# Altium schematic sheet Laser protection.SchDoc: AI ARTIQ Driver
size 420 x 297 mm; Author: G.Kasprowicz; CompanyName: CTI; Organization: CTI; Address1: CTI; Address2: Nowowiejska 15/19 00-665 Warsaw; Address3: gkasprow@gmail.com; DocumentNumber: 6; Revision: 0.2; SheetNumber: 6; SheetTotal: 11; ModifiedBy: -; CheckedDate: -; Title2: protection; DivGrp: CTI; ModifiedDate: -; ProjectName: Sensor Box
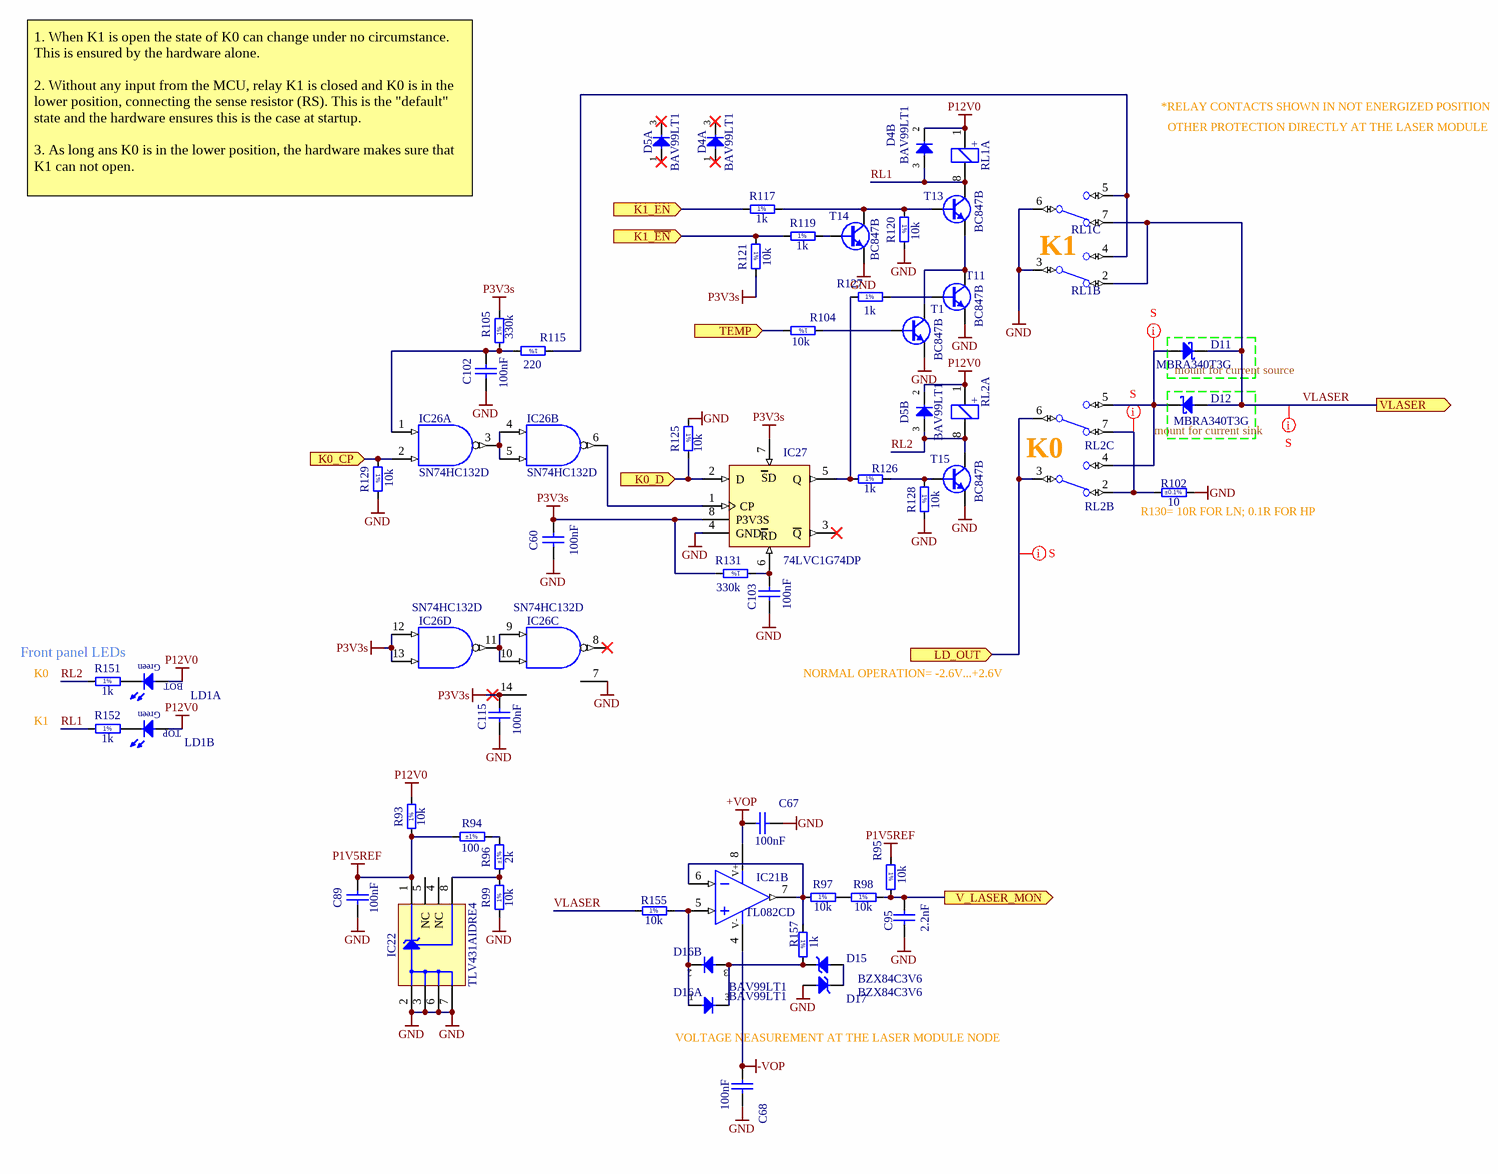
[diagram p0: Laser protection.SchDoc]

## Parts
C60  100nF  [CAPC1608X87N]
C67  100nF  [CAPC1608X87N]
C68  100nF  [CAPC1608X87N]
C89  100nF  [CAPC1608X87N]
C95  2.2nF  [CAPC1608X87N]
C102  100nF  [CAPC1608X87N]
C103  100nF  [CAPC1608X87N]
C115  100nF  [CAPC1608X87N]
D4  BAV99LT1  [SOT95P240X110-3N]  (parts A,B of 2)
D5  BAV99LT1  [SOT95P240X110-3N]  (parts A,B of 2)
D11  MBRA340T3G  [DIOM5226X220N]
D12  MBRA340T3G  [DIOM5226X220N]
D15  BZX84C3V6  [SOT95P240X130-3N]
D16  BAV99LT1  [SOT95P240X110-3N]  (parts A,B of 2)
D17  BZX84C3V6  [SOT95P240X130-3N]
IC21  TL082CD  [SOIC127P600X175-8N]  (part B of 2)
IC22  TLV431AIDRE4  [SOIC127P600X175-8N]
IC26  SN74HC132D  [SOIC127P600X175-14N]  (parts A,B,C,D of 4)
IC27  74LVC1G74DP  [SOP65P400X110-8N]
LD1  Green/Green  [LED_DIALIGHT_571-0122F]  (value not drawn)  (parts A,B of 2)
R93  10k  [RESC1608X55N]
R94  100  Tolerance: ±1%  [RESC1608X55N]
R95  10k  [RESC1608X55N]
R96  2k  Tolerance: ±1%  [RESC1608X55N]
R97  10k  [RESC1608X55N]
R98  10k  [RESC1608X55N]
R99  10k  [RESC1608X55N]
R102  10  Tolerance: ±0.1%  [RESC6531X85N]
R104  10k  [RESC1608X55N]
R105  330k  [RESC1608X55N]
R115  220  [RESC1608X55N]
R117  1k  [RESC1608X55N]
R119  1k  [RESC1608X55N]
R120  10k  [RESC1608X55N]
R121  10k  [RESC1608X55N]
R125  10k  [RESC1608X55N]
R126  1k  [RESC1608X55N]
R127  1k  [RESC1608X55N]
R128  10k  [RESC1608X55N]
R129  10k  [RESC1608X55N]
R131  330k  [RESC1608X55N]
R151  1k  [RESC1608X55N]
R152  1k  [RESC1608X55N]
R155  10k  [RESC1608X55N]
R157  1k  [RESC1608X55N]
RL1  REL_TYCO_IM Non-latching  [REL_TYCO_IMXXXGX]  (value not drawn)  (parts A,B,C of 3)
RL2  REL_TYCO_IM Non-latching  [REL_TYCO_IMXXXGX]  (value not drawn)  (parts A,B,C of 3)
T1  BC847B  [SOT95P230X110-3N]
T11  BC847B  [SOT95P230X110-3N]
T13  BC847B  [SOT95P230X110-3N]
T14  BC847B  [SOT95P230X110-3N]
T15  BC847B  [SOT95P230X110-3N]

## Blocks framed on the sheet
mount for current source: D11

## Ports
K0_CP (in), K0_D (in), K1_EN (in), K1_~{EN} (in), LD_OUT (in), TEMP (in), V_LASER_MON (out), VLASER (out)

## Nets
+VOP: C67.1 IC21.8(V+)
-VOP: C68.1 IC21.4(V-)
GND: C60.1 C67.2 C68.2 C89.1 C95.1 C102.1 C103.1 C115.1 D17.1(A) IC22.2(A) IC22.3(A) IC22.6(A) IC22.7(A) IC26.7(GND) IC27.4(GND) R99.1 R102.2 R120.2 R125.1 R128.2 R129.2 RL1.3(C) RL1.6(C) T1.2(E) T11.2(E) T14.2(E) T15.2(E)
P1V5REF: C89.2 IC22.1(C) R93.1 R94.2 R95.1
P3V3s: C60.2 C115.2 IC26.12(A) IC26.13(B) IC26.14(VCC) IC27.7(~{S}D) IC27.8(P3V3S) R105.2 R121.2 R131.2  [also labelled VCC]
P12V0: D4.2(C) D5.2(C) LD1.2(A) LD1.4(A) R93.2 RL1.1 RL2.1
K0_CP: IC26.2(B) R129.1 ; port K0_CP
K0_D: IC27.2(D) R125.2 ; port K0_D
K1_~{EN}: R119.1 R121.1 ; port K1_~{EN}
K1_EN: R117.1 ; port K1_EN
LD_OUT: RL2.3(C) RL2.6(C) ; port LD_OUT
RL1: D4.3(COMAC) R152.1 RL1.8 T13.3(C)
RL2: D5.3(COMAC) R151.1 RL2.8 T15.3(C)
TEMP: R104.2 ; port TEMP
V_LASER_MON: C95.2 R95.2 R98.2 ; port V_LASER_MON
VLASER: D11.1(C) D12.2(A) R155.1 RL1.2(NC) RL1.7(NC) ; port VLASER
NetC102_2: C102.2 IC26.1(A) R105.1 R115.2
NetC103_2: C103.2 IC27.6(~{RD}) R131.1
NetD11_2: D11.2(A) D12.1(C) RL2.4(NO) RL2.5(NO)
NetD15_1: D15.1(A) D17.3(C)
NetD15_3: D15.3(C) D16.3(COMAC) R157.2
NetD16_1: D16.1(A) D16.2(C) IC21.5(IN+) R155.2
NetIC21_6: IC21.6(IN-) IC21.7(OUT) R97.1 R157.1
NetIC22_8: IC22.8(REF) R96.1 R99.2
NetIC26_3: IC26.3(~{O}) IC26.4(A) IC26.5(B)
NetIC26_6: IC26.6(~{O}) IC27.1(CP)
NetIC26_9: IC26.9(A) IC26.10(B) IC26.11(~{O})
NetIC27_5: IC27.5(Q) R126.1 R127.1
NetLD1_1: LD1.1(C) R151.2
NetLD1_3: LD1.3(C) R152.2
NetR94_1: R94.1 R96.2
NetR97_2: R97.2 R98.1
NetR102_1: R102.1 RL2.2(NC) RL2.7(NC)
NetR104_1: R104.1 T1.1(B)
NetR115_1: R115.1 RL1.4(NO) RL1.5(NO)
NetR117_2: R117.2 R120.1 T13.1(B) T14.3(C)
NetR119_2: R119.2 T14.1(B)
NetR126_2: R126.2 R128.1 T15.1(B)
NetR127_2: R127.2 T11.1(B)
NetT1_3: T1.3(C) T11.3(C) T13.2(E)

Not connected (* = marked no-connect by the designer): D4 1(A)*; D5 1(A)*; IC22 4(NC) 5(NC); IC26 8(~{O})*; IC27 3(~{Q})*

## Layout directives
net class Sensitive: LD_OUT, NetD11_2, NetR102_1, VLASER

## Notes on the sheet
- *RELAY CONTACTS SHOWN IN NOT ENERGIZED POSITION
- OTHER PROTECTION DIRECTLY AT THE LASER MODULE
- 1. When K1 is open the state of K0 can change under no circumstance. This is ensured by the hardware alone.
  2. Without any input from the MCU, relay K1 is closed and K0 is in the lower position, connecting the sense resistor (RS). This is the "default" state and the hardware ensures this is the case at startup.
  3. As long ans K0 is in the lower position, the hardware makes sure that K1 can not open.
- (near RL1) K1
- (near D12) mount for current sink
- (near RL2) K0
- (near R102) R130= 10R FOR LN; 0.1R FOR HP
- Front panel LEDs
- K0
- NORMAL OPERATION= -2.6V...+2.6V
- K1
- VOLTAGE NEASUREMENT AT THE LASER MODULE NODE
- Project/Equipment
- Document
- Designer
- Drawn by
- Check.by
- Copyright Creotech Instruments SA 2014.
  This documentation describes Open Hardware and is licensed under the CERN OHL v.1.1. You may redistribute and modify this documentation under the terms of the CERN OHL v.1.1. (http://ohwr.org/CERNOHL). This documentation is distributed WITHOUT ANY EXPRESS OR IMPLIED WARRANTY, INCLUDING OF MERCHANTABILITY, SATISFACTORY QUALITY AND FITNESS FOR A PARTICULAR PURPOSE. Please see the CERN OHL v.1.1 for applicable conditions.
- File
- Last Mod.
- Print Date
- Sheet
- Size
- A3
- of
- Rev
- (in symbol 74LVC1G74DP) SD; RD
- (in symbol LED_DIALIGHT_571-0122F, part A) Green; BOT
- (in symbol LED_DIALIGHT_571-0122F, part B) Green; TOP
- (in symbol R0603_1K_1%_0.1W_100PPM) 1%
- (in symbol R0603_10K_1%_0.1W_100PPM) 1%
- (in symbol R0603_220R_1%_0.1W_100PPM) 1%
- (in symbol R0603_330K_1%_0.1W_100PPM) 1%
- (in symbol REL_TYCO_IM06CGR, part A) +

## Library data of the parts
C60 C67 C68 C89 C102 C103 C115 = CC0603_100NF_50V_10%_X7R: Non-polarised capacitor; Part Description: SMD Multilayer Chip Ceramic Capacitor; Manufacturer: GENERIC; Manufacturer1 Part Number: 223858615649; Voltage: 50V; TC: X7R; Tolerance: ±10%; Part Number: CC0603_100NF_50V_10%_X7R; Component Kind: Standard; Component Type: Standard; Pin Count: 2; Value: 100nF; Status: Preferred; Manufacturer Part Number: CC0603_100NF_50V_10%_X7R; Case: 0603; Mounted: Yes; Socket: No; SMD: Yes; Sense: No; Manufacturer1 Example: PHYCOMP; Manufacturer1 ComponentHeight: 0.87mm; HelpURL: \\cern.ch\dfs\Applications\Altium\Datasheets\CC0603_X7R_PHYCOMP.pdf; Author: CERN DEM JLC; CreateDate: 03.12.2007; LatestRevisionDate: 03.12.2007
C95 = CC0603_2.2NF_50V_5%_C0G: Non-polarised capacitor; Part Description: SMD Multilayer Chip Ceramic Capacitor; Manufacturer: GENERIC; Manufacturer1 Part Number: C1608C0G1H222J080AA; Voltage: 50V; TC: C0G/NP0; Tolerance: ±5%; Part Number: CC0603_2.2NF_50V_5%_C0G; Component Kind: Standard; Component Type: Standard; Pin Count: 2; Value: 2.2nF; Status: Preferred; Manufacturer Part Number: CC0603_2.2NF_50V_5%_C0G; Case: 0603; Mounted: Yes; Socket: No; SMD: Yes; Sense: No; Manufacturer1 Example: TDK; Manufacturer1 ComponentHeight: 0.9mm; HelpURL: \\cern.ch\dfs\Applications\Altium\Datasheets\CC0603_C0G_TDK_C.pdf; Author: CERN DEM JMW; CreateDate: 23.06.2014; LatestRevisionDate: 23.06.2014
D4 D5 D16 = BAV99LT1: Serial Diode; Part Description: Dual Series Switching Diode; Manufacturer: ON SEMICONDUCTOR; Voltage: 70V; Power: 225mW; PressFit: No; Bonding: No; Part Number: BAV99LT1; Component Kind: Standard; Component Type: Standard; Device: BAV99LT1; PackageDescription: SOT, 0.95mm Pitch; 3 Pin, 1.40mm W X 3.00mm L X 1.10mm H body, IPC Medium Density; Status: Obsolete; Manufacturer Part Number: BAV99LT1; Pin Count: 3; Case: SOT23-3; Mounted: Yes; Socket: No; SMD: Yes; Sense: No; ComponentHeight: 1.11mm; HelpURL: \\cern.ch\dfs\Applications\Altium\Datasheets\BAV99LT1.pdf; Author: CERN DEM JLC; CreateDate: 12.02.2009; LatestRevisionDate: 12.02.2009
D11 D12 = MBRA340T3G: Schottky Diode; Part Description: Schottky Power Rectifier; Manufacturer: ON SEMICONDUCTOR; Voltage: 40V; Power: 3A; PressFit: No; Bonding: No; Part Number: MBRA340T3G; Component Kind: Standard; Component Type: Standard; Device: MBRA340T3G; PackageDescription: DO-214-AC/SMA Diode, Molded Body; 5.21mm L X 2.60mm W X 2.20mm H, IPC Medium Density; Manufacturer Part Number: MBRA340T3G; Pin Count: 2; Case: DO-214AC; Mounted: Yes; Socket: No; SMD: Yes; Sense: No; ComponentHeight: 2.20mm; HelpURL: \\cern.ch\dfs\Applications\Altium\Datasheets\MBRA340T3G.pdf; Author: CERN DEM JLC; CreateDate: 18.06.2012; LatestRevisionDate: 18.06.2012
D15 D17 = BZX84C3V6: Diode Zener Anode Pin 1 Cathode Pin 3 (Pas de pin 2); Part Description: Zener Diode; Manufacturer: FAIRCHILD SEMICONDUCTOR; Voltage: 3V6; Power: 350mW; PressFit: No; Bonding: No; Part Number: BZX84C3V6; Component Kind: Standard; Component Type: Standard; Device: BZX84C3V6; PackageDescription: SOT, 0.95mm Pitch; 3 Pin, 1.30mm W X 2.90mm L X 1.30mm H body, IPC Medium Density; Manufacturer Part Number: BZX84C3V6; Pin Count: 3; Case: SOT23-3; Mounted: Yes; Socket: No; SMD: Yes; Sense: No; ComponentHeight: 1.3mm; HelpURL: \\cern.ch\dfs\Applications\Altium\Datasheets\BZX84C3V6.pdf; Author: CERN DEM JLC; CreateDate: 06.10.2016; LatestRevisionDate: 06.10.2016
IC21 = TL082CD: Dual Operational Amplifier; Part Description: Dual JFET-Input Operational Amplifier; Manufacturer: TEXAS INSTRUMENTS; PressFit: No; Bonding: No; Part Number: TL082CD; Component Kind: Standard; Component Type: Standard; Device: TL082CD; PackageDescription: SOIC 8, Pitch 1.27mm - Body 4x5mm, IPC Medium Density; Manufacturer Part Number: TL082CD; Pin Count: 8; Case: SOIC8; Mounted: Yes; Socket: No; SMD: Yes; Sense: No; ComponentHeight: 1.75mm; Author: CERN DEM JLC; HelpURL: \\cern.ch\dfs\Applications\Altium\Datasheets\TL082CD.pdf; CreateDate: 20.05.2010; LatestRevisionDate: 20.05.2010
IC22 = TL431CD: Precision Programmable Reference; Part Description: Vref (1.25V) To 36V 2% Precision Programmable Reference; Manufacturer: TEXAS INSTRUMENTS; PressFit: No; Bonding: No; Part Number: TLV431AIDRE4; Component Kind: Standard; Component Type: Standard; Device: TLV431AIDRE4; PackageDescription: SOIC 8, Pitch 1.27mm, Body 4x5mm, IPC Medium Density; Manufacturer Part Number: TLV431AIDRE4; Pin Count: 8; Case: SOIC8; Mounted: Yes; Socket: No; SMD: Yes; Sense: No; ComponentHeight: 1.75mm; HelpURL: \\cern.ch\dfs\Applications\Altium\Datasheets\TL431CD.pdf; Author: CERN DEM JLC; CreateDate: 18.01.2011; LatestRevisionDate: 28.02.2011
IC26 = SN74HC132D: Quad Positive NAND Gate With Schmitt-Trigger Input; Manufacturer: TEXAS INSTRUMENTS; PressFit: No; Bonding: No; Part Number: SN74HC132D; Component Kind: Standard; Component Type: Standard; Device: SN74HC132D; PackageDescription: SOIC 14, Pitch 1.27mm - Body 4x8.75mm, IPC Medium Density; Part Description: Quad Positive NAND Gate With Schmitt-Trigger Input; Manufacturer Part Number: SN74HC132D; Pin Count: 14; Case: SOIC14; Mounted: Yes; Socket: No; SMD: Yes; Sense: No; ComponentHeight: 1.75mm; Author: CERN DEM JLC; HelpURL: \\cern.ch\dfs\Applications\Altium\Datasheets\SN74HC132D.pdf; CreateDate: 21.08.2008; LatestRevisionDate: 21.08.2008
IC27 = 74LVC1G74DP: Single D-type flip-flop with set and reset, positive edge trigger; Manufacturer: NXP SEMICONDUCTORS; PressFit: No; Bonding: No; Part Number: 74LVC1G74DP; Component Kind: Standard; Component Type: Standard; Device: 74LVC1G74DP; PackageDescription: SOP, 0.65mm, pitch; 8 pin, 3.00mm W X 3.00mm L X 1.10mm H body, PC Medium Density; Part Description: Single D-Type Flip-Flop With Set And Reset, Positive Edge Trigger; Manufacturer Part Number: 74LVC1G74DP; Pin Count: 8; Case: TSSOP8; Mounted: Yes; Socket: No; SMD: Yes; Sense: No; ComponentHeight: 1.1mm; Author: CERN DEM JLC; HelpURL: \\cern.ch\dfs\Applications\Altium\Datasheets\74LVC1G74DP.pdf; CreateDate: 26.04.2010; LatestRevisionDate: 26.04.2010
LD1 = LED_DIALIGHT_571-0122F: LED x2 Green 1C2A-BOT_3C4A-TOP; Part Description: Dual 2mm Green LEDs CBI® Circuit Board Indicator (Without positioning pins); PressFit: No; Bonding: No; Part Number: LED_DIALIGHT_571-0122F; Component Kind: Standard; Component Type: Standard; Color: Green/Green; PackageDescription: 2x 2mm Red LED PCB Edge Mounting (Without positioning pins) DIALIGHT 571 Serie; Manufacturer: DIALIGHT; Manufacturer Part Number: 571-0122F; Pin Count: 4; Mounted: Yes; Socket: No; SMD: No; Sense: No; ComponentHeight: 8.6mm; HelpURL: \\cern.ch\dfs\Applications\Altium\Datasheets\LED_DIALIGHT_571-0122F.pdf; Author: CERN DEM JLC; CreateDate: 09.11.2009; LatestRevisionDate: 17.03.2010
R93 R95 R97-R99 R104 R120 R121 R125 R128 R129 R155 = R0603_10K_1%_0.1W_100PPM: Resistor - 1%; Part Description: General Purpose Thick Film Chip Resistor; Manufacturer: GENERIC; Manufacturer1 Part Number: NRC06F1002TRF; Power: 0.1W; TC: ±100ppm/°C; PressFit: No; Part Number: R0603_10K_1%_0.1W_100PPM; Component Kind: Standard; Component Type: Standard; Pin Count: 2; Value: 10k; Status: Preferred; Tolerance: ±1%; Manufacturer Part Number: R0603_10K_1%_0.1W_100PPM; Case: 0603; Mounted: Yes; Sense: No; Socket: No; SMD: Yes; Manufacturer1 Example: NIC COMPONENT; Manufacturer1 ComponentHeight: 0.55mm; HelpURL: \\cern.ch\dfs\Applications\Altium\Datasheets\R0603_NIC_NRC.pdf; Author: CERN DEM JLC; CreateDate: 03.12.2007; LatestRevisionDate: 13.03.2008
R94 = R0603_100R_1%_0.1W_100PPM: Resistor - 1%; Part Description: General Purpose Thick Film Chip Resistor; Manufacturer: GENERIC; Manufacturer1 Part Number: NRC06F4700TRF; Power: 0.1W; TC: ±100ppm/°C; PressFit: No; Part Number: R0603_100R_1%_0.1W_100PPM; Component Kind: Standard; Component Type: Standard; Pin Count: 2; Value: 100; Status: Preferred; Manufacturer Part Number: R0603_100R_1%_0.1W_100PPM; Case: 0603; Mounted: Yes; Sense: No; Socket: No; SMD: Yes; Manufacturer1 Example: NIC COMPONENT; Manufacturer1 ComponentHeight: 0.55mm; HelpURL: \\cern.ch\dfs\Applications\Altium\Datasheets\R0603_NIC_NRC.pdf; Author: CERN DEM JLC; CreateDate: 03.12.2007; LatestRevisionDate: 13.03.2008
R96 = R0603_2K_1%_0.1W_100PPM: Resistor - 1%; Part Description: General Purpose Thick Film Chip Resistor; Manufacturer: GENERIC; Manufacturer1 Part Number: NRC06F2001TRF; Power: 0.1W; TC: ±100ppm/°C; PressFit: No; Part Number: R0603_2K_1%_0.1W_100PPM; Component Kind: Standard; Component Type: Standard; Pin Count: 2; Value: 2k; Status: Preferred; Manufacturer Part Number: R0603_2K_1%_0.1W_100PPM; Case: 0603; Mounted: Yes; Sense: No; Socket: No; SMD: Yes; Manufacturer1 Example: NIC COMPONENT; Manufacturer1 ComponentHeight: 0.55mm; HelpURL: \\cern.ch\dfs\Applications\Altium\Datasheets\R0603_NIC_NRC.pdf; Author: CERN DEM JLC; CreateDate: 03.12.2007; LatestRevisionDate: 13.03.2008
R102 = R2512_10R_0.1%_2.5W_25PPM: Resistor - 0.1%; Part Description: High Power Thin Film Wraparound Chip Resistor; Manufacturer: VISHAY DALE; Manufacturer Part Number: PHP02512E10R0BST3; Power: 2.5W; TC: ±25ppm/°C; PressFit: No; Part Number: R2512_10R_0.1%_2.5W_25PPM; Component Kind: Standard; Component Type: Standard; Pin Count: 2; Value: 10; Status: Not Recommended; Case: 2512; Mounted: Yes; Sense: No; Socket: No; SMD: Yes; ComponentHeight: 0.84mm; HelpURL: \\cern.ch\dfs\Applications\Altium\Datasheets\R2512_VISHAY_PHP.pdf; Author: CERN DEM JLC; CreateDate: 06.06.2017; LatestRevisionDate: 06.06.2017
R105 R131 = R0603_330K_1%_0.1W_100PPM: Resistor - 1%; Part Description: General Purpose Thick Film Chip Resistor; Manufacturer: GENERIC; Manufacturer1 Part Number: NRC06F3303TRF; Power: 0.1W; TC: ±100ppm/°C; PressFit: No; Part Number: R0603_330K_1%_0.1W_100PPM; Component Kind: Standard; Component Type: Standard; Pin Count: 2; Value: 330k; Status: Preferred; Tolerance: ±1%; Manufacturer Part Number: R0603_330K_1%_0.1W_100PPM; Case: 0603; Mounted: Yes; Sense: No; Socket: No; SMD: Yes; Manufacturer1 Example: NIC COMPONENT; Manufacturer1 ComponentHeight: 0.55mm; HelpURL: \\cern.ch\dfs\Applications\Altium\Datasheets\R0603_NIC_NRC.pdf; Author: CERN DEM JLC; CreateDate: 03.12.2007; LatestRevisionDate: 13.03.2008
R115 = R0603_220R_1%_0.1W_100PPM: Resistor - 1%; Part Description: General Purpose Thick Film Chip Resistor; Manufacturer: GENERIC; Manufacturer1 Part Number: NRC06F2200TRF; Power: 0.1W; TC: ±100ppm/°C; Part Number: R0603_220R_1%_0.1W_100PPM; Component Kind: Standard; Component Type: Standard; Pin Count: 2; Value: 220; Status: Preferred; Tolerance: ±1%; Manufacturer Part Number: R0603_220R_1%_0.1W_100PPM; Case: 0603; Mounted: Yes; Sense: No; Socket: No; SMD: Yes; Manufacturer1 Example: NIC COMPONENT; Manufacturer1 ComponentHeight: 0.55mm; HelpURL: \\cern.ch\dfs\Applications\Altium\Datasheets\R0603_NIC_NRC.pdf; Author: CERN DEM JLC; CreateDate: 03.12.2007; LatestRevisionDate: 13.03.2008
R117 R119 R126 R127 R151 R152 R157 = R0603_1K_1%_0.1W_100PPM: Resistor - 1%; Part Description: General Purpose Thick Film Chip Resistor; Manufacturer: GENERIC; Manufacturer1 Part Number: NRC06F1001TRF; Power: 0.1W; TC: ±100ppm/°C; PressFit: No; Part Number: R0603_1K_1%_0.1W_100PPM; Component Kind: Standard; Component Type: Standard; Pin Count: 2; Value: 1k; Status: Preferred; Tolerance: ±1%; Manufacturer Part Number: R0603_1K_1%_0.1W_100PPM; Case: 0603; Mounted: Yes; Sense: No; Socket: No; SMD: Yes; Manufacturer1 Example: NIC COMPONENT; Manufacturer1 ComponentHeight: 0.55mm; HelpURL: \\cern.ch\dfs\Applications\Altium\Datasheets\R0603_NIC_NRC.pdf; Author: CERN DEM JLC; CreateDate: 03.12.2007; LatestRevisionDate: 13.03.2008
RL1 RL2 = REL_TYCO_IM06CGR: IM Signal Relay (Monostable 1 Coil Non-latching); Part Description: 2A/250VAC, DPDT  (2 Form C) SMT High Dielectric Signal Relay, IM Series; Manufacturer: TYCO AXICOM; Manufacturer Part Number: IM06CGR or 9-1462037-9; PressFit: No; Value: 12VDC; Sense Comment: Cleaning Limitation; Status Comment: Sensitive (See Sensitive Field); Part Number: REL_TYCO_IM06CGR; Component Kind: Standard; Component Type: Standard; Pin Count: 8; PackageDescription: 8 Gull Wings Leads SMT Relay, IM Series, Body 10mm x 6mm; Mounted: Yes; Socket: No; SMD: Yes; Sense: Yes; Status: Not Recommended; ComponentHeight: 5.65mm; HelpURL: \\cern.ch\dfs\Applications\Altium\Datasheets\REL_TYCO_IM06CGR.pdf; Author: CERN DEM JLC; CreateDate: 04.12.2013; LatestRevisionDate: 04.12.2013
T1 T11 T13-T15 = BC847B: NPN Transistor; Part Description: 45V 100mA NPN general-purpose transistors; Manufacturer: NXP SEMICONDUCTORS; PressFit: No; Bonding: No; Part Number: BC847B; Component Kind: Standard; Component Type: Standard; Device: BC847B; PackageDescription: SOT23, 0.95mm Pitch; 3 Pin, 1.30mm W X 2.90mm L X 1.10mm H body, IPC Medium Density; Manufacturer Part Number: BC847B; Pin Count: 3; Case: SOT23-3; Mounted: Yes; Socket: No; SMD: Yes; Sense: No; ComponentHeight: 1.1mm; HelpURL: \\cern.ch\dfs\Applications\Altium\Datasheets\BC847B.pdf; Author: CERN DEM JLC; CreateDate: 14.06.2011; LatestRevisionDate: 14.06.2011